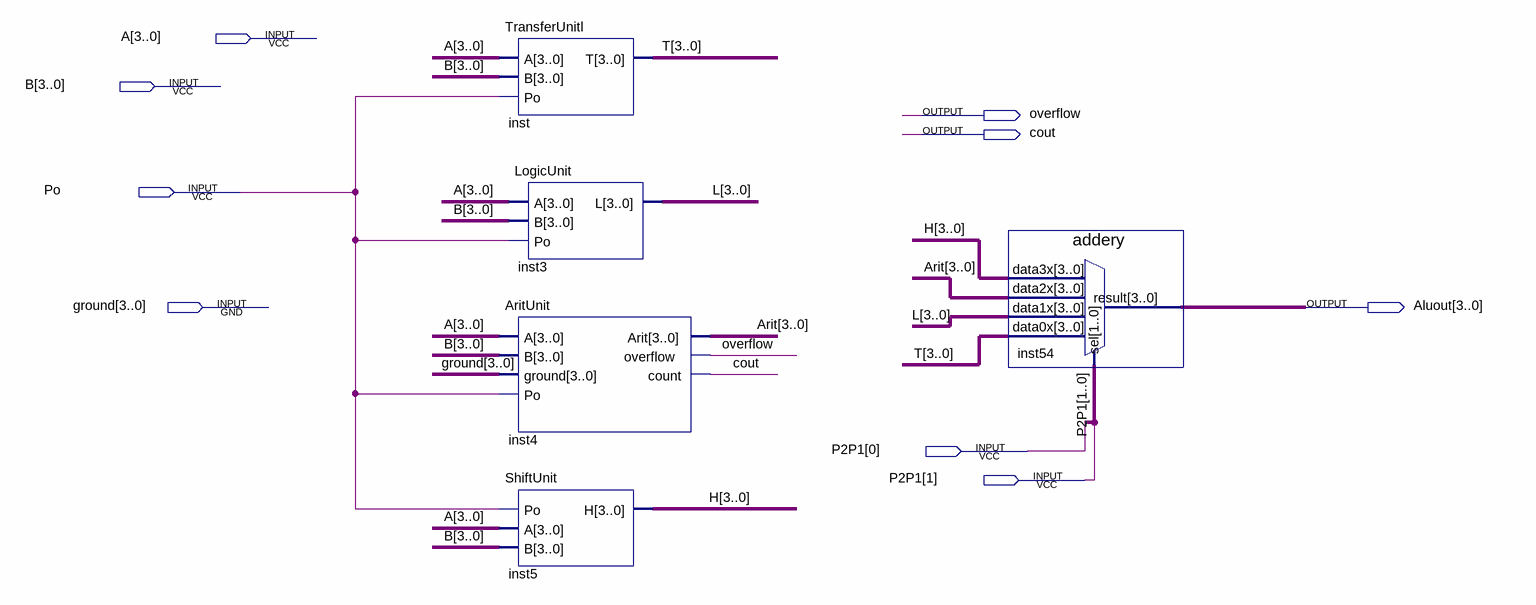
[diagram p0: schematic sheet]
// Quartus schematic AluFinal.bdf as structural Verilog: 5 symbols, 9 pins
module AluFinal (
  input  [3:0] A,
  input  [3:0] B,
  input  Po,
  input  [3:0] ground,
  input  [1:0] P2P1,
  output overflow,
  output cout,
  output [3:0] Aluout
);

  wire [3:0] Arit, H, L, T;

  TransferUnitl inst (.A(A), .B(B), .Po(Po), .T(T));
  LogicUnit inst3 (.A(A), .B(B), .Po(Po), .L(L));
  AritUnit inst4 (.A(A), .B(B), .ground(ground), .Po(Po), .Arit(Arit), .overflow(overflow), .count(cout));
  ShiftUnit inst5 (.Po(Po), .A(A), .B(B), .H(H));
  addery inst54 (.data3x(H), .data2x(Arit), .data1x(L), .data0x(T), .sel(P2P1), .result(Aluout));
endmodule
